# EAGLE design Precharge_Board (EAGLE 5.12)
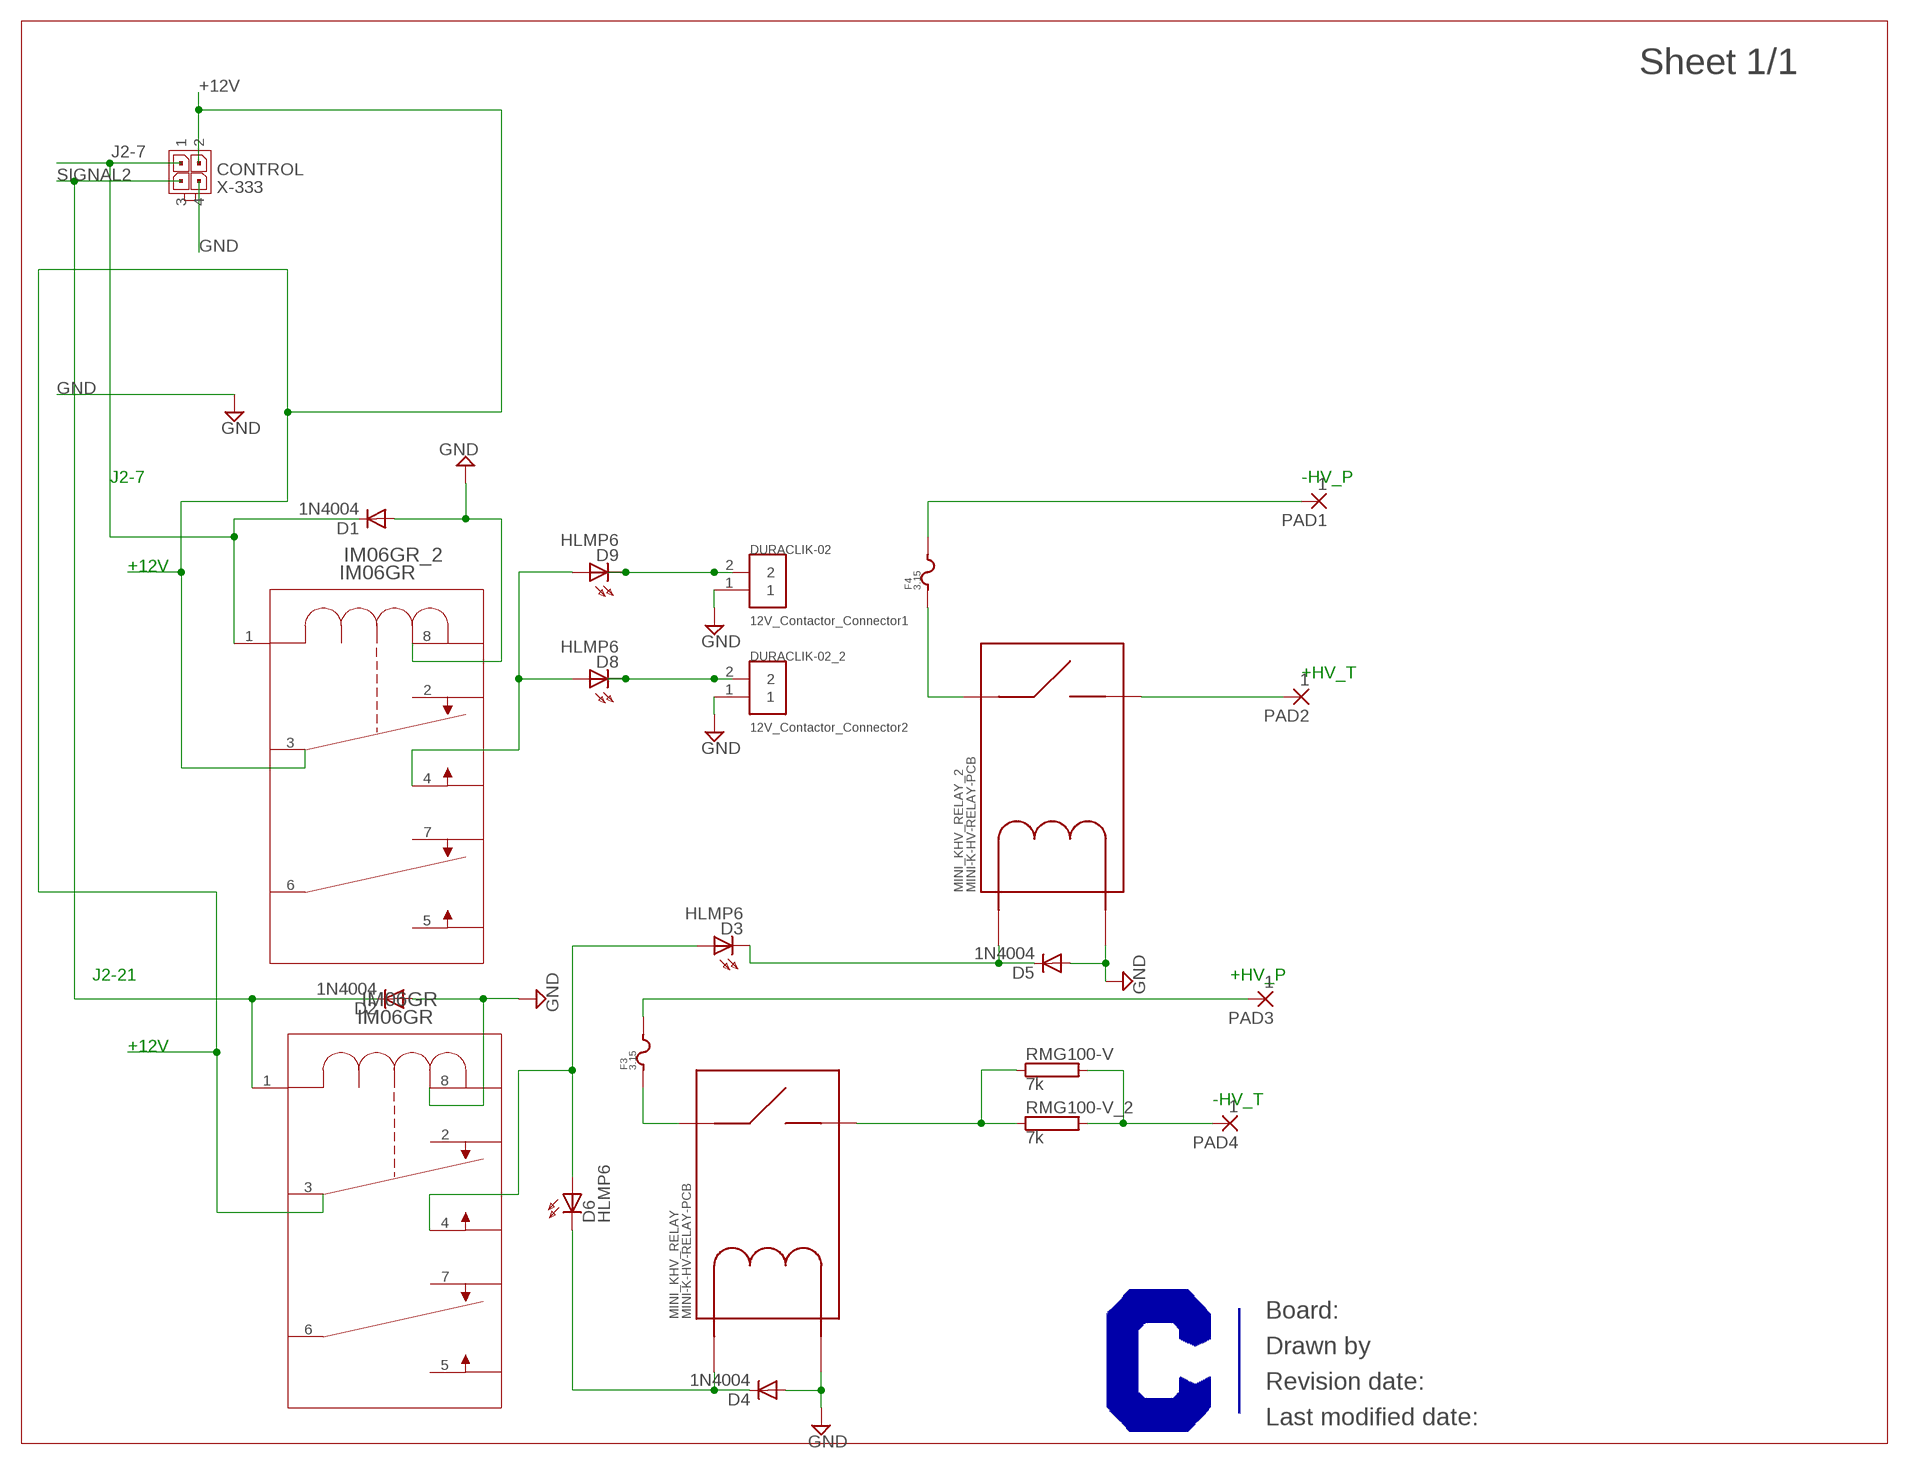
[diagram p0: schematic, sheet 1]

## Parts
D1  1N4004  [DO41-10]
D2  1N4004  [DO41-10]
D3  HLMP6  [HLMP6]
D4  1N4004  [DO41-10]
D5  1N4004  [DO41-10]
D6  HLMP6  [HLMP6]
D8  HLMP6  [HLMP6]
D9  HLMP6  [HLMP6]
DURACLIK-02  12V_Contactor_Connector1  DURACLIK02  [DURACLIK-02]
DURACLIK-02_2  12V_Contactor_Connector2  DURACLIK02  [DURACLIK-02]
F3  3.15  FUSE-1206  [1206]
F4  3.15  FUSE-1206  [1206]
IM06GR  IM06GR  [RELAY_IM_SMT]
IM06GR_2  IM06GR  [RELAY_IM_SMT]
MINI_KHV_RELAY  MINI-K-HV-RELAY-PCB  [MINI-K-RELAY_V23700C_PCB]
MINI_KHV_RELAY_2  MINI-K-HV-RELAY-PCB  [MINI-K-RELAY_V23700C_PCB]
PAD1  1  2,54/1,0  [2,54/1,0]
PAD2  1  2,54/1,0  [2,54/1,0]
PAD3  1  2,54/1,0  [2,54/1,0]
PAD4  1  2,54/1,0  [2,54/1,0]
RMG100-V  7k  RMG100-V  [TO-247-2V]
RMG100-V_2  7k  RMG100-V  [TO-247-2V]
U$1  CURRENT-C-LETTER-LANDSCAPE  [BLANK]
X-333  CONTROL  MICROFIT-04-DUAL-RA-SMD-CLIP_RETENTION  [MICROFIT-4-DUAL-RA-SMD-CLIP_RETENTION]

## Nets
+12V: IM06GR.3(3_2) IM06GR_2.3(3_2) X-333.2
+HV_P: F3.2 PAD3.1(P)
+HV_T: MINI_KHV_RELAY_2.7 PAD2.1(P)
-HV_P: F4.2 PAD1.1(P)
-HV_T: PAD4.1(P) RMG100-V.2 RMG100-V_2.2
GND: D1.A D2.A D4.A D5.A DURACLIK-02.1 DURACLIK-02_2.1 IM06GR.8 IM06GR_2.8 MINI_KHV_RELAY.2(COIL-) MINI_KHV_RELAY_2.2(COIL-) X-333.4
J2-7: D1.C IM06GR_2.1 X-333.1
N$1: F3.1 MINI_KHV_RELAY.5
N$2: D8.A D9.A IM06GR_2.4
N$3: D3.A D6.A IM06GR.4
N$4: MINI_KHV_RELAY.7 RMG100-V.1 RMG100-V_2.1
N$6: D9.K DURACLIK-02.2
N$7: D3.K D5.C MINI_KHV_RELAY_2.1(COIL+)
N$8: D8.K DURACLIK-02_2.2
N$10: D4.C D6.K MINI_KHV_RELAY.1(COIL+)
N$11: F4.1 MINI_KHV_RELAY_2.5
SIGNAL2: D2.C IM06GR.1 X-333.3
Unconnected: IM06GR.2 IM06GR.5 IM06GR.6 IM06GR.7 IM06GR_2.2 IM06GR_2.5 IM06GR_2.6 IM06GR_2.7

## Notes on the sheet
- J2-7 | -HV_P
- +12V
- +HV_T
- J2-21 | +HV_P
- +12V
- -HV_T

## Library data of the parts
D1 D2 D4 D5 = diode:1N4004: DIODE general purpose rectifier, 1 A
D3 D6 D8 D9 = display-hp:HLMP6: LED 2mm horizontal; MF: AGILENT TECHNOLOGIES; MPN: HLMP-6500; OC_FARNELL: 1652490; OC_NEWARK: 40K0088
DURACLIK-02 DURACLIK-02_2 = BMC components:DURACLIK
F3 F4 = Fuses_JOHN:FUSE
IM06GR IM06GR_2 = IM06GR-Relay:IM06GR; MANUFACTURER_PART_NUMBER: IM06GR; VENDOR: Tyco Electronics
MINI_KHV_RELAY MINI_KHV_RELAY_2 = TE-Aaron:MINI-K-HV-RELAY: TE Mini K HV Relay; PARTNO: V23700-C0001-A408
PAD1-PAD4 = wirepad:2,54/1,0: THROUGH-HOLE PAD
RMG100-V RMG100-V_2 = JOHN:RMG100: TO-247 Power Resistor - RMG 100 Series Source: www.token.com.tw .. power-resistor-rmg100pdf; OC_FARNELL: unknown; OC_NEWARK: unknown
U$1 = Frames:CURRENT-C-LETTER-LANDSCAPE; BOM: EXCLUDE
X-333 = Molex:MICROFIT-04-DUAL: Molex MicroFit 3.00mm Pitch Header, Surface Mount, Dual Row, 4 Circuits Molex P/N: 43045-0609 (vert) Drawing: http://www.molex.com/pdm_docs/sd/430450418_sd.pdf (vert) Information: http://www.molex.com/molex/products/datasheet.jsp?part=active/0430450418_PCB_HEADERS.xml (vert)

## Board
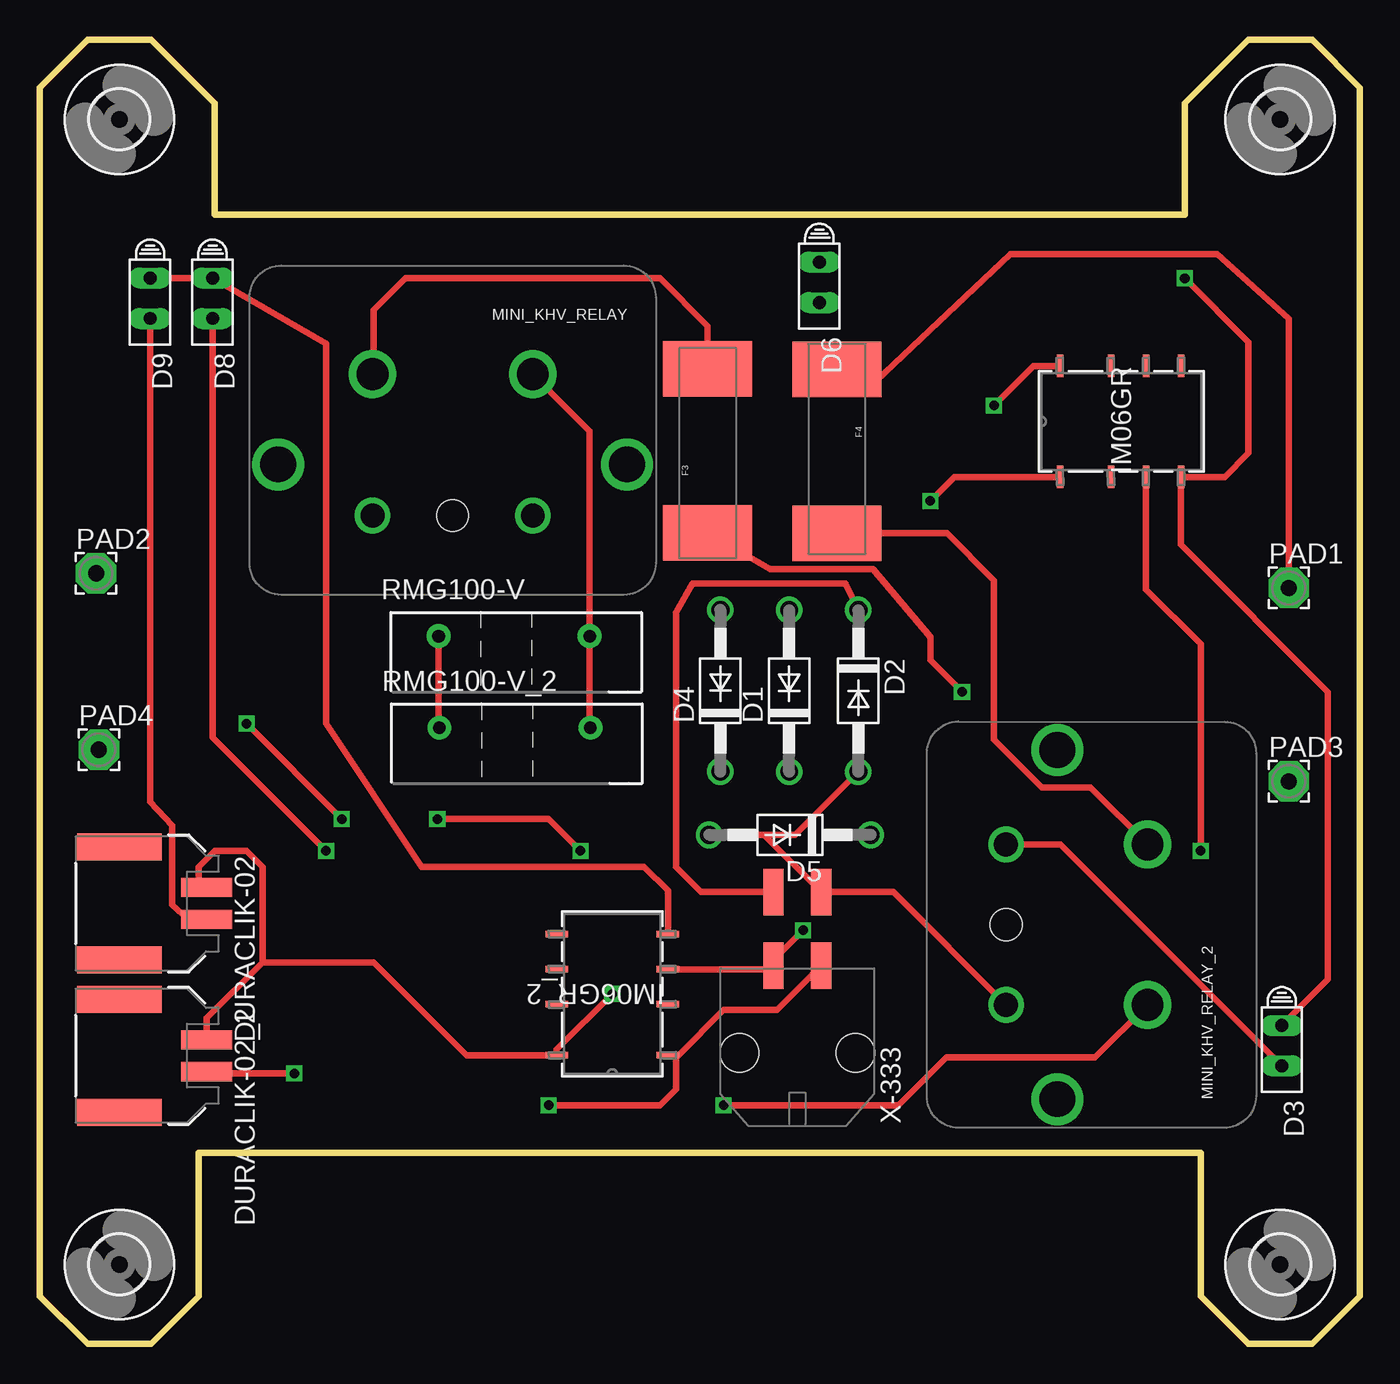
[diagram p1: board, top side]
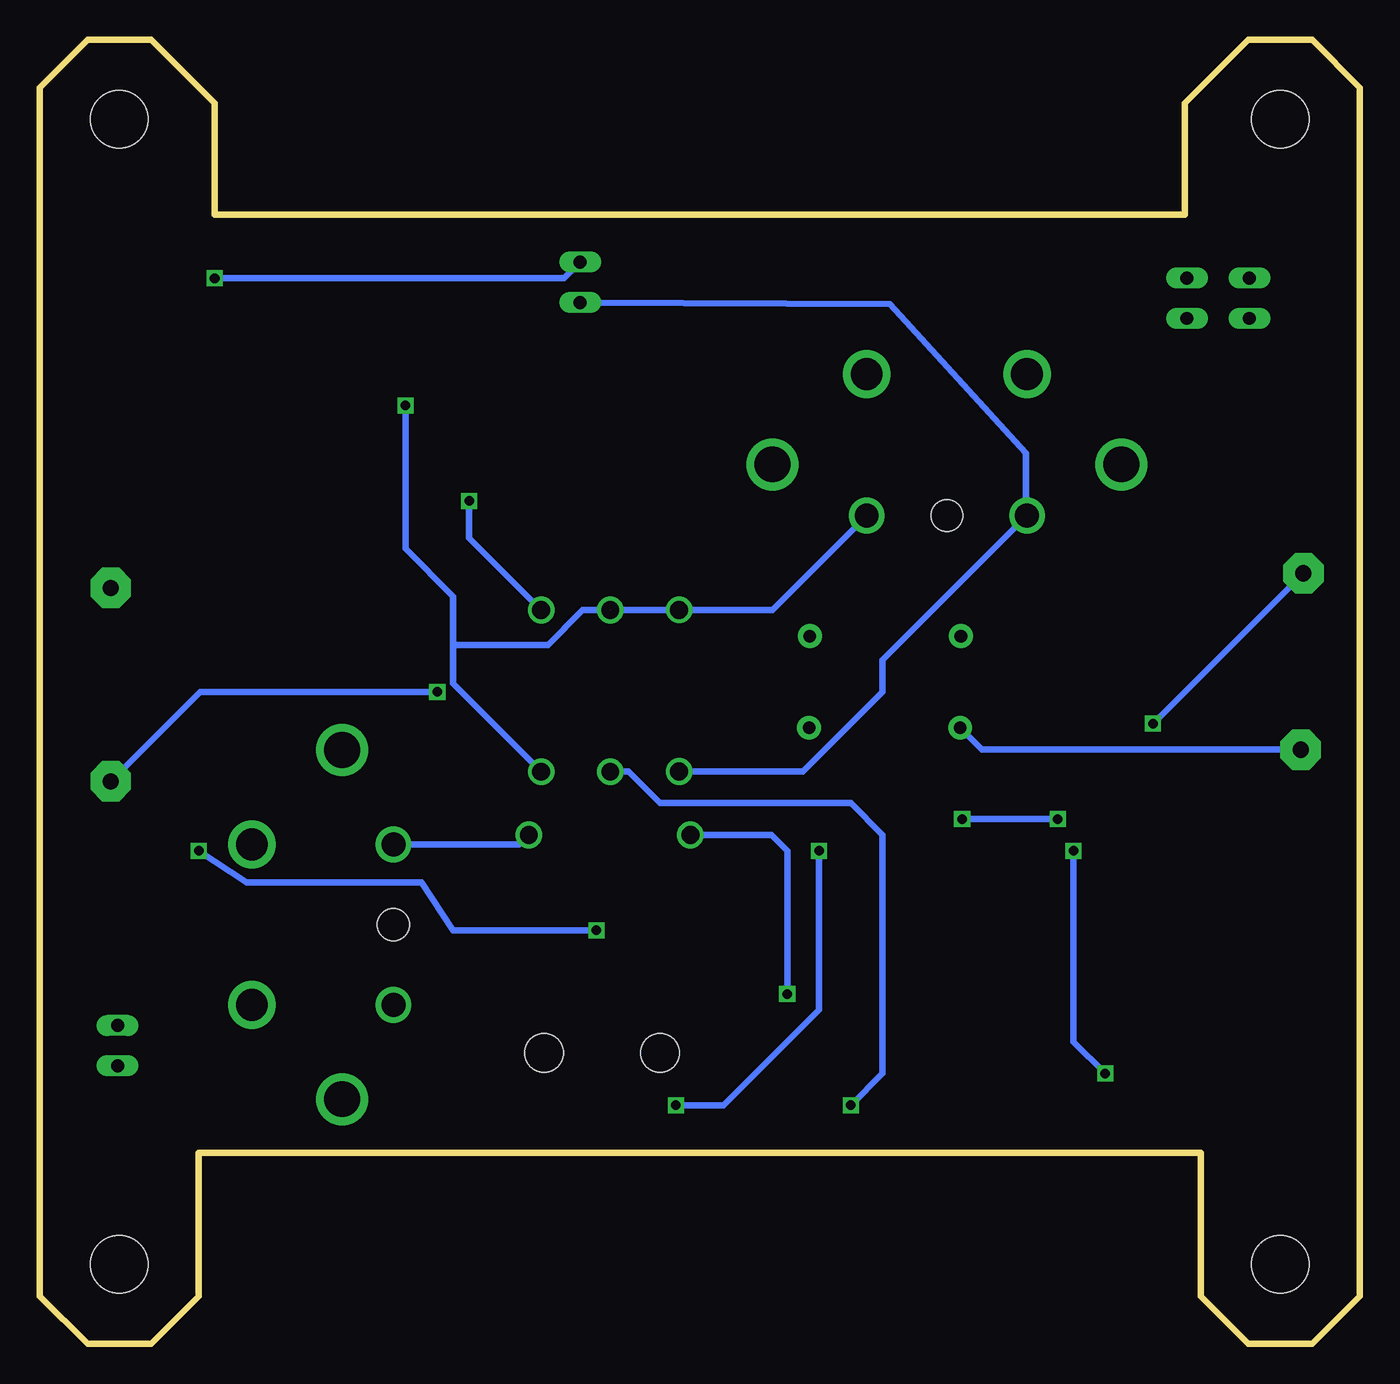
[diagram p2: board, bottom side, seen from below]

Size 83 x 82 mm. Coordinates in mm from the lower left corner, seen from the top.
Outline: 0,79 3,82 7,82 11,78 11,71 72,71 72,78 76,82 80,82 83,79 83,3 80,0 76,0 73,3 73,12 10,12 10,3 7,0 3,0 0,3 0,79
Copper layers (1*16): Top 0.035mm / dielectric 1.5mm / Bottom 0.035mm
Design rules "default *": minimum track width 10mil, minimum drill 13mil, track to track 8mil, track to pad 8mil, pad to pad 8mil, via to via 8mil, smd to smd 8mil, copper to edge 40mil, drill to drill 8mil, minimum pad ring 10mil, minimum via ring 8mil, stop-mask expansion 4mil, vias tented up to drill 0mil, thermal gap 10mil

### Footprints (pad centres in the part's own frame; a part is rotated, then mirrored left to right if it is on the bottom)
DO41-10 = drill 1.118 round: A 5.08,0; C -5.08,0
HLMP6 = drill 0.813 long: A -1.27,0; K 1.27,0
DURACLIK-02 = smd 1.2 x 3.2: 1 -1,8.23; 2 1,8.23 | smd 1.7 x 5.3: P$3 -3.55,2.75; P$4 3.55,2.75
1206 = smd 3.5 x 5.6: 1 10.3,0; 2 0,0
RELAY_IM_SMT = smd 1.422 x 0.406: 1 -3.493,3.848; 2 -3.493,0.648; 3 -3.493,-1.552; 4 -3.493,-3.752; 5 3.493,-3.752; 6 3.493,-1.552; 7 3.493,0.648; 8 3.493,3.848
MINI-K-RELAY_V23700C_PCB = drill 1.5 round: 1 5.04,0; 2 -5.04,0 | drill 2 round: 5 5.04,-8.9; 7 -5.04,-8.9 | drill 2.25 round: 8A -10.975,-3.22; 8B 10.975,-3.22 | hole 2: 0,0
2,54/1,0 = drill 1.016 pad 2.54 octagon: 1 0,0
TO-247-2V = drill 0.8 pad 1.5 round: 1 5.5,1.5; 2 -4,1.5
3,6 = hole 3.6: 0,0
MICROFIT-4-DUAL-RA-SMD-CLIP_RETENTION = smd 1.27 x 2.921: 1 1.5,5.47; 2 -1.5,5.47; 3 -1.5,10.1; 4 1.5,10.1 | hole 2.413: 3.65,0; -3.65,0

### Placement (x,y rotation side)
D1  47.12,41.06 90 top
D2  51.47,41.06 270 top
D3  78.1,18.75 270 top
D4  42.8,41.07 90 top
D5  47.17,32 180 top
D6  49.02,66.75 270 top
D8  10.86,65.75 270 top
D9  6.94,65.75 270 top
DURACLIK-02  2.26,27.69 270 top
DURACLIK-02_2  2.26,18.12 270 top
F3  42,51 90 top
F4  50.12,61.27 270 top
IM06GR  68,58 90 top
IM06GR_2  36,22 180 top
MINI_KHV_RELAY  25.96,52.08 180 top
MINI_KHV_RELAY_2  60.76,26.36 90 top
PAD1  78.54,47.53 0 top
PAD2  3.54,48.45 0 top
PAD3  78.54,35.37 0 top
PAD4  3.71,37.36 0 top
RMG100-V  29.08,43 0 top
RMG100-V_2  29.12,37.24 0 top
U$1  -27.94,93.01 0 top  (outside the outline)
U$2  [3,6]  78,77 0 top
U$3  [3,6]  5,77 0 top
U$4  [3,6]  5,5 0 top
U$5  [3,6]  78,5 0 top
X-333  47.64,18.31 0 top

### Tracks (layer width: path | path; a pad name or v marks a point on that pad's centre or on a via)
+12V  (via drill 0.6)
  Top 0.406: IM06GR_2.3 46.14,23.55 X-333.2 46.14,24.14 v48,26 | v73,31 73,43.99 69.56,47.43 69.56,54.5 IM06GR.3
  Bottom 0.406: v48,26 57,26 59,29 70,29 v73,31
+HV_P  (via drill 0.6)
  Top 0.406: F3.2 45.93,48.71 52.38,48.71 56,44.45 56,43 v58,41
  Bottom 0.406: PAD3.1 72.91,41 v58,41
+HV_T  (via drill 0.6)
  Top 0.406: MINI_KHV_RELAY_2.7 66.34,18 57,18 54,15 v43,15 | v34,31 32,33 v25,33 | v18.99,33 v18.99,33.01 v13,39
  Bottom 0.406: v43,15 40,15 34,21 v34,31 | v18.99,33 v25,33 | v13,39 v12.99,39 PAD2.1
-HV_P
  Top 0.406: PAD1.1 78.54,64.46 74.03,68.52 61.03,68.52 52,60 51.39,60 F4.2
-HV_T
  Top 0.406: RMG100-V_2.2 25.08,38.78 RMG100-V.2
  Bottom 0.406: PAD4.1 23.74,37.36 RMG100-V_2.2
GND  (via drill 0.6)  (1 unrouted)
  Top 0.406: D5.A 45.55,32 | 45.55,32 X-333.4 53.67,28.41 MINI_KHV_RELAY_2.2 | DURACLIK-02_2.1 10.49,20.49 14,24 | 14,24 14,30 13,31 11,31 10,30 10,29.18 DURACLIK-02.1 | 14,24 21,24 26.85,18.15 IM06GR_2.8 32.51,18.51 v36,22 | IM06GR.8 62.49,61.49 v60,59 | 45.55,32 47.49,32 D2.A
  Bottom 0.406: D1.A D4.A 36.93,46.15 MINI_KHV_RELAY.2 | v36,22 36,31 37,32 D5.A | v60,59 60,50 57,47 57,44 | 57,44 57,41.51 D2.A | D1.A 48.86,46.14 50,45 50,44.98 51.03,43.94 56.94,43.94 57,44
J2-7  (via drill 0.6)
  Top 0.406: 40,18.15 IM06GR_2.1 | 40,18.15 40.15,18.15 43,21 46.36,21 X-333.1 | v32,15 39,15 40,16 40,18.15
  Bottom 0.406: D1.C 45.98,35.98 44,34 32,34 30,32 30,17 v32,15
N$1
  Top 0.406: F3.1 42,64 39,67 23,67 21,65 21,61.06 MINI_KHV_RELAY.5
N$2
  Top 0.406: IM06GR_2.4 39.49,28.51 38,30 24,30 18,39 18,62.88 D8.A D9.A
N$3  (via drill 0.6)
  Top 0.406: v72,67 76,63 76,56 74.51,54.51 IM06GR.4 71.75,50.25 81,41 81,22.92 D3.A
  Bottom 0.406: v72,67 50.04,67 D6.A
N$4
  Top 0.406: RMG100-V_2.1 34.58,38.78 RMG100-V.1 34.58,57.4 MINI_KHV_RELAY.7
N$6
  Top 0.406: D9.K 6.94,34.06 8.33,32.59 8.33,27.59 9,27 10.18,27 DURACLIK-02.2
N$7
  Top 0.406: D3.K 64.18,31.4 MINI_KHV_RELAY_2.1
  Bottom 0.406: D5.C 52.85,31.4 MINI_KHV_RELAY_2.1
N$8  (via drill 0.6)
  Top 0.406: D8.K 10.86,38.14 v18,31 | v16,17 10.61,17 DURACLIK-02_2.2
  Bottom 0.406: v18,31 18,19 v16,17
N$10
  Bottom 0.406: D4.C 35.01,35.99 30,41 30,43 MINI_KHV_RELAY.1 21,52.16 21,56 29.54,65.39 D6.K
N$11
  Top 0.406: MINI_KHV_RELAY_2.5 66.06,35 63,35 60,38 60,48 57.03,50.97 F4.1
SIGNAL2  (via drill 0.6)
  Top 0.406: X-333.3 41.59,28.41 40,30 40,46 41.05,47.8 50.66,47.8 D2.C | IM06GR.1 57.51,54.51 v56,53
  Bottom 0.406: v56,53 56,50.67 D2.C